# Altium project USB_Hub.PrjPcb
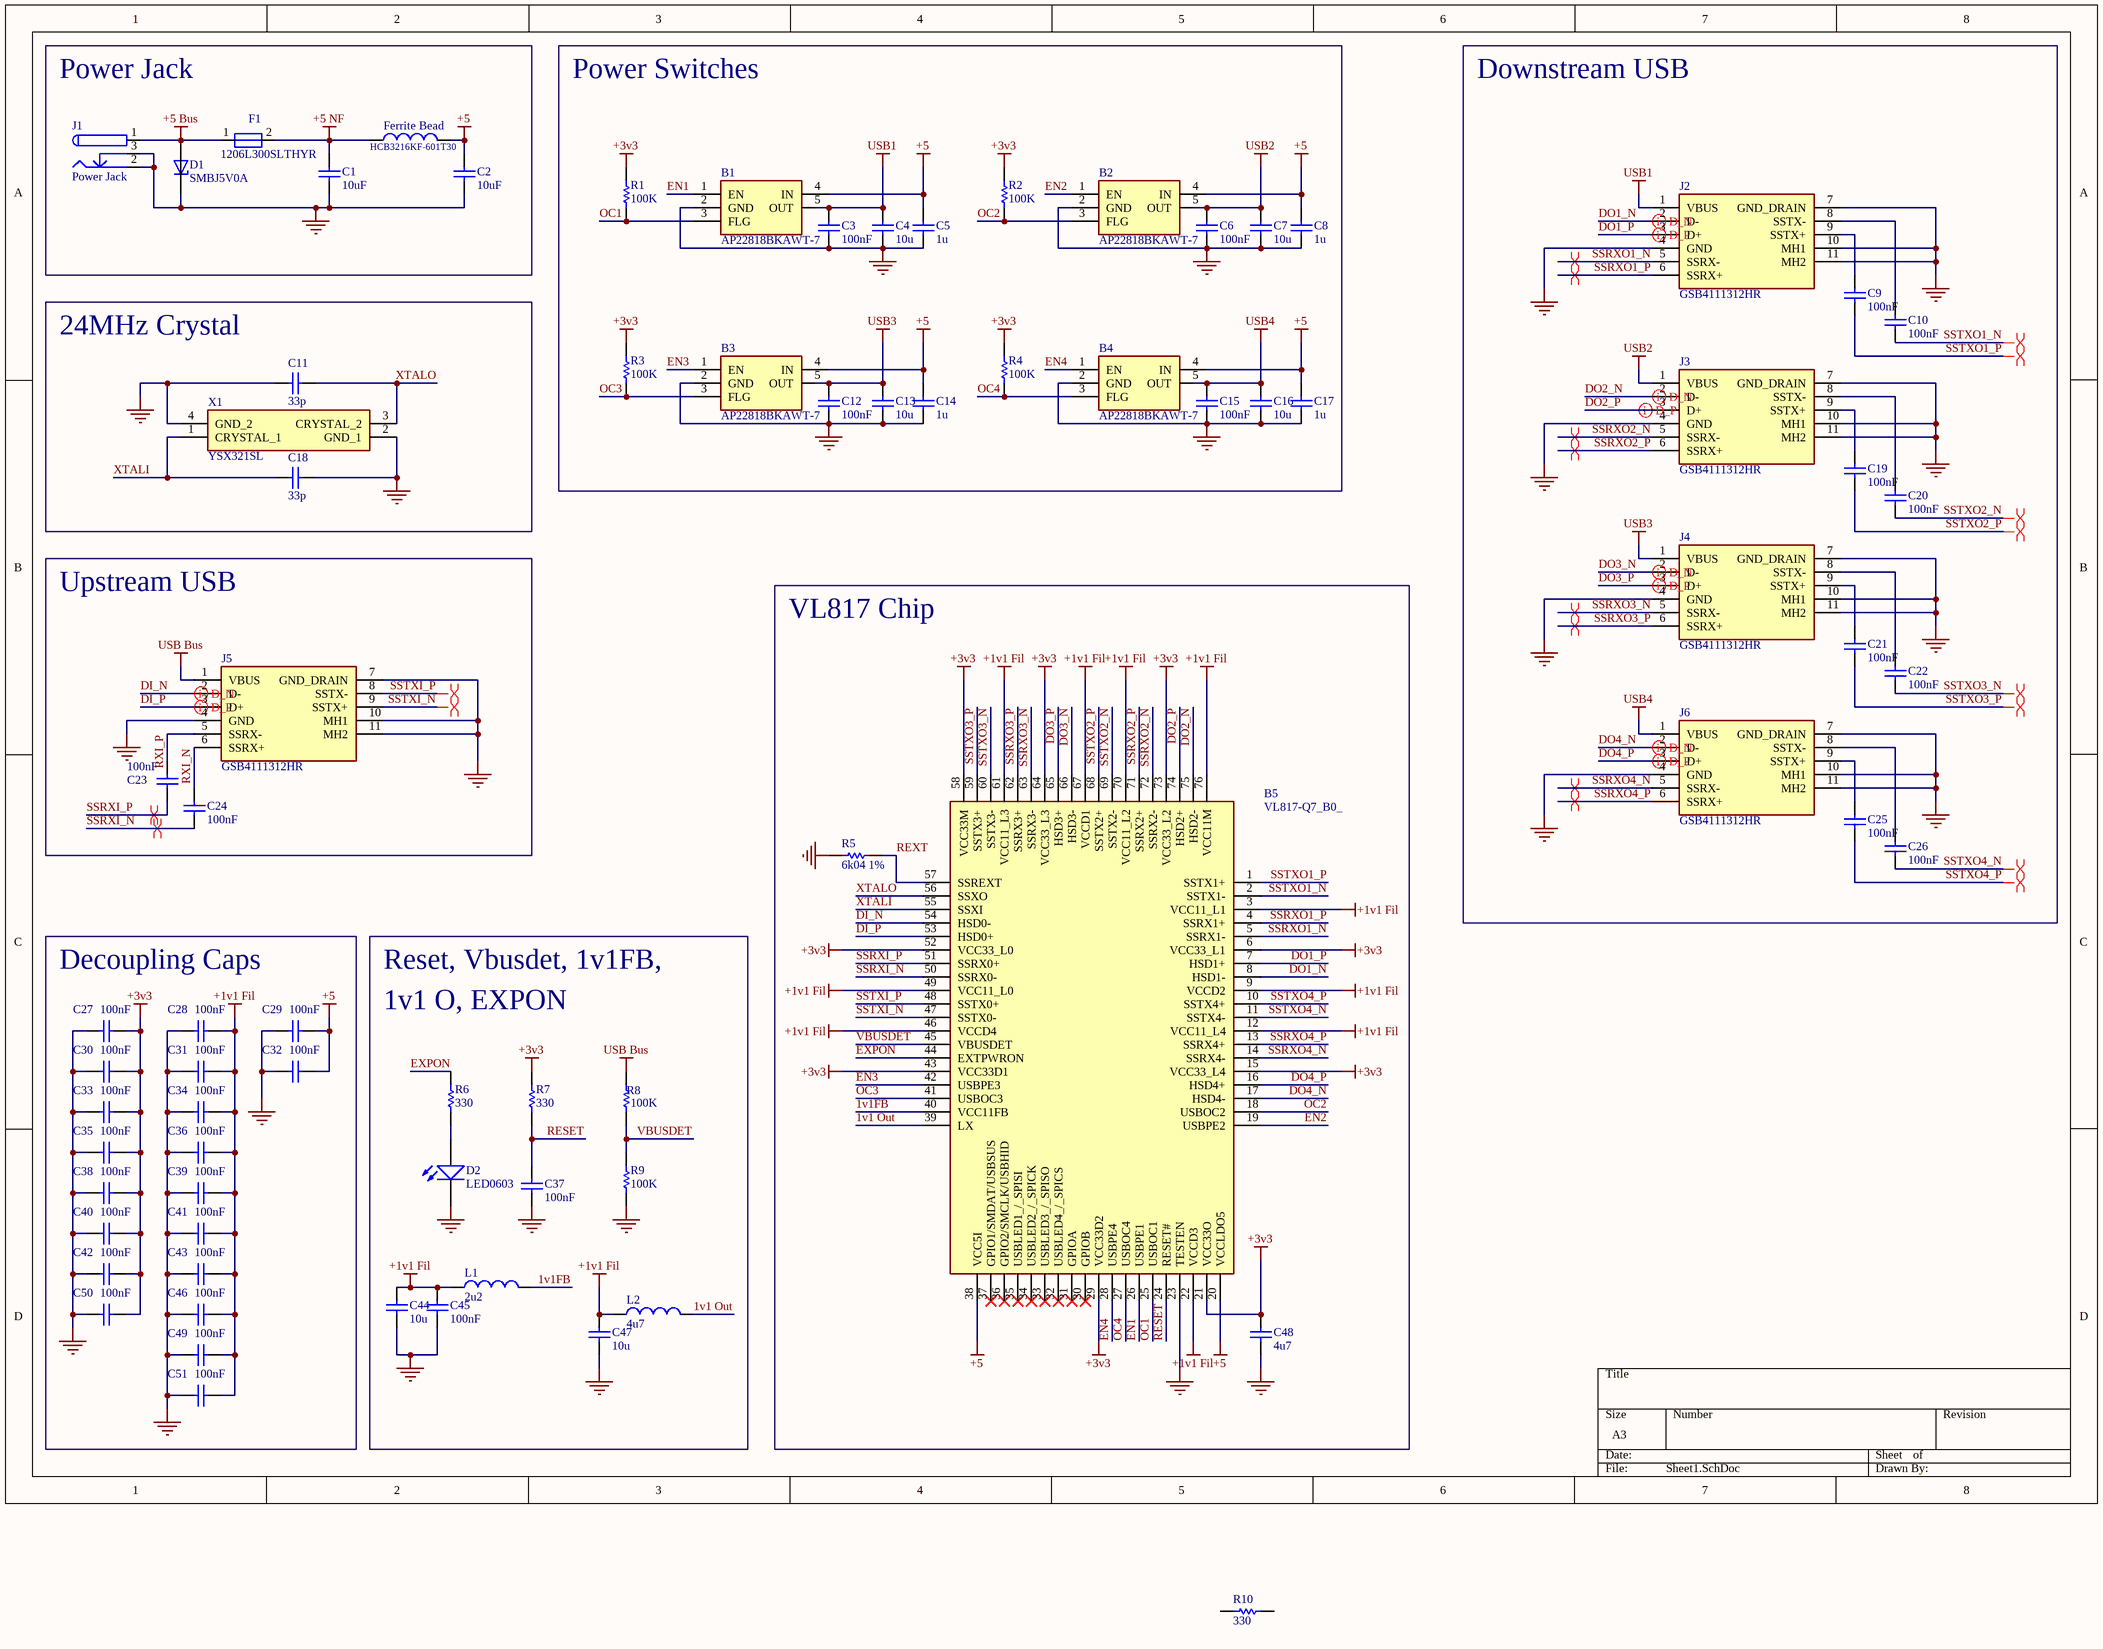
[diagram p0: Sheet1.SchDoc]
1 sheet, 79 parts. Net scope: global (net labels, ports and power ports of the same name join across sheets).
Board file: Hub.PcbDoc

## Sheet Sheet1.SchDoc
size A3; SheetNumber: 3; SheetTotal: 3

### Parts
B1  AP22818BKAWT-7  [SOT95P280X100-5N]
B2  AP22818BKAWT-7  [SOT95P280X100-5N]
B3  AP22818BKAWT-7  [SOT95P280X100-5N]
B4  AP22818BKAWT-7  [SOT95P280X100-5N]
B5  VL817-Q7_B0_  [QFN40P900X900X90-77N-D]
C1  10uF  [CAP1206]
C2  10uF  [CAP1206]
C3  100nF  [CAP0402]
C4  10u  [CAP0603]
C5  1u  [CAP0603]
C6  100nF  [CAP0402]
C7  10u  [CAP0603]
C8  1u  [CAP0603]
C9  100nF  [CAP0402]
C10  100nF  [CAP0402]
C11  33p  [CAP0402]
C12  100nF  [CAP0402]
C13  10u  [CAP0603]
C14  1u  [CAP0603]
C15  100nF  [CAP0402]
C16  10u  [CAP0603]
C17  1u  [CAP0603]
C18  33p  [CAP0402]
C19  100nF  [CAP0402]
C20  100nF  [CAP0402]
C21  100nF  [CAP0402]
C22  100nF  [CAP0402]
C23  100nF  [CAP0402]
C24  100nF  [CAP0402]
C25  100nF  [CAP0402]
C26  100nF  [CAP0402]
C27  100nF  [CAP0402]
C28  100nF  [CAP0402]
C29  100nF  [CAP0402]
C30  100nF  [CAP0402]
C31  100nF  [CAP0402]
C32  100nF  [CAP0402]
C33  100nF  [CAP0402]
C34  100nF  [CAP0402]
C35  100nF  [CAP0402]
C36  100nF  [CAP0402]
C37  100nF  [CAP0402]
C38  100nF  [CAP0402]
C39  100nF  [CAP0402]
C40  100nF  [CAP0402]
C41  100nF  [CAP0402]
C42  100nF  [CAP0402]
C43  100nF  [CAP0402]
C44  10u  [CAP0603]
C45  100nF  [CAP0402]
C46  100nF  [CAP0402]
C47  10u  [CAP0603]
C48  4u7  [CAP0603]
C49  100nF  [CAP0402]
C50  100nF  [CAP0402]
C51  100nF  [CAP0402]
D1  SMBJ5V0A  [DIOM4336X265N]
D2  LED0603  [LED_SMD_0603]
F1  1206L300SLTHYR  [FUSC3115X66N]
Ferrite_Bead  HCB3216KF-601T30  [IND1206]
J1  Power Jack  [Power Jack]
J2  GSB4111312HR  [GSB4111312HR]
J3  GSB4111312HR  [GSB4111312HR]
J4  GSB4111312HR  [GSB4111312HR]
J5  GSB4111312HR  [GSB4111312HR]
J6  GSB4111312HR  [GSB4111312HR]
L1  2u2  [IND0603]
L2  4u7  [IND0603]
R1  100K  [RES0603]
R2  100K  [RES0603]
R3  100K  [RES0603]
R4  100K  [RES0603]
R5  6k04 1%  [RES0603]
R6  330  [RES0603]
R7  330  [RES0603]
R8  100K  [RES0603]
R9  100K  [RES0603]
R10  value 330  [Res50]  (hidden comment: Resistor vertical)
X1  YSX321SL  [YSX321SL]

### Blocks framed on the sheet
Power Jack: C1 C2 D1 F1 Ferrite_Bead J1
Power Switches: B1-B4 C3-C8 C12-C17 R1-R4
Downstream USB: C9 C10 C19-C22 C25 C26 J2-J4 J6
24MHz Crystal: C11 C18 X1
Upstream USB: C23 C24 J5
VL817 Chip: B5 C48 R5
Decoupling Caps: C27-C36 C38-C43 C46 C49-C51

### Nets
+1v1 Fil: B5.3(VCC11_L1) B5.9(VCCD2) B5.12(VCC11_L4) B5.22(VCCD3) B5.46(VCCD4) B5.49(VCC11_L0) B5.61(VCC11_L3) B5.67(VCCD1) B5.70(VCC11_L2) B5.76(VCC11M) C28.2 C31.2 C34.2 C36.2 C39.2 C41.2 C43.2 C44.2 C45.2 C46.2 C47.2 C49.2 C51.2 L1.1 L2.1
+3v3: B5.6(VCC33_L1) B5.15(VCC33_L4) B5.21(VCC33O) B5.29(VCC33D2) B5.43(VCC33D1) B5.52(VCC33_L0) B5.58(VCC33M) B5.64(VCC33_L3) B5.73(VCC33_L2) C27.2 C30.2 C33.2 C35.2 C38.2 C40.2 C42.2 C48.2 C50.2 R1.2 R2.2 R3.2 R4.2 R7.2
+5: B1.4(IN) B2.4(IN) B3.4(IN) B4.4(IN) B5.20(VCCLDO5) B5.38(VCC5I) C2.2 C5.2 C8.2 C14.2 C17.2 C29.2 C32.2 Ferrite_Bead.2
+5 Bus: D1.A F1.1 J1.1
+5 NF: C1.2 F1.2 Ferrite_Bead.1
GND: B1.2(GND) B2.2(GND) B3.2(GND) B4.2(GND) B5.23(TESTEN) C1.1 C2.1 C3.1 C4.1 C5.1 C6.1 C7.1 C8.1 C11.2 C12.1 C13.1 C14.1 C15.1 C16.1 C17.1 C18.1 C27.1 C28.1 C29.1 C30.1 C31.1 C32.1 C33.1 C34.1 C35.1 C36.1 C37.1 C38.1 C39.1 C40.1 C41.1 C42.1 C43.1 C44.1 C45.1 C46.1 C47.1 C48.1 C49.1 C50.1 C51.1 D1.C D2.1(K) J1.2 J1.3 J2.4(GND) J2.7(GND_DRAIN) J2.10(MH1) J2.11(MH2) J3.4(GND) J3.7(GND_DRAIN) J3.10(MH1) J3.11(MH2) J4.4(GND) J4.7(GND_DRAIN) J4.10(MH1) J4.11(MH2) J5.4(GND) J5.7(GND_DRAIN) J5.10(MH1) J5.11(MH2) J6.4(GND) J6.7(GND_DRAIN) J6.10(MH1) J6.11(MH2) R5.2 R9.1 X1.2(GND_1) X1.4(GND_2)
USB1: B1.5(OUT) C3.2 C4.2 J2.1(VBUS)
USB2: B2.5(OUT) C6.2 C7.2 J3.1(VBUS)
USB3: B3.5(OUT) C12.2 C13.2 J4.1(VBUS)
USB4: B4.5(OUT) C15.2 C16.2 J6.1(VBUS)
USB Bus: J5.1(VBUS) R8.2
1v1 Out: B5.39(LX) L2.2
1v1FB: B5.40(VCC11FB) L1.2
DI_N: B5.54(HSD0-) J5.2(D-)
DI_P: B5.53(HSD0+) J5.3(D+)
DO1_N: B5.8(HSD1-) J2.2(D-)
DO1_P: B5.7(HSD1+) J2.3(D+)
DO2_N: B5.75(HSD2-) J3.2(D-)
DO2_P: B5.74(HSD2+) J3.3(D+)
DO3_N: B5.66(HSD3-) J4.2(D-)
DO3_P: B5.65(HSD3+) J4.3(D+)
DO4_N: B5.17(HSD4-) J6.2(D-)
DO4_P: B5.16(HSD4+) J6.3(D+)
EN1: B1.1(EN) B5.26(USBPE1)
EN2: B2.1(EN) B5.19(USBPE2)
EN3: B3.1(EN) B5.42(USBPE3)
EN4: B4.1(EN) B5.28(USBPE4)
EXPON: B5.44(EXTPWRON) R6.2
OC1: B1.3(FLG) B5.25(USBOC1) R1.1
OC2: B2.3(FLG) B5.18(USBOC2) R2.1
OC3: B3.3(FLG) B5.41(USBOC3) R3.1
OC4: B4.3(FLG) B5.27(USBOC4) R4.1
RESET: B5.24(RESET#) C37.2 R7.1
REXT: B5.57(SSREXT) R5.1
RXI_N: C24.2 J5.6(SSRX+)
RXI_P: C23.2 J5.5(SSRX-)
SSRXI_N: B5.50(SSRX0-) C24.1
SSRXI_P: B5.51(SSRX0+) C23.1
SSRXO1_N: B5.5(SSRX1-) J2.5(SSRX-)
SSRXO1_P: B5.4(SSRX1+) J2.6(SSRX+)
SSRXO2_N: B5.72(SSRX2-) J3.5(SSRX-)
SSRXO2_P: B5.71(SSRX2+) J3.6(SSRX+)
SSRXO3_N: B5.63(SSRX3-) J4.5(SSRX-)
SSRXO3_P: B5.62(SSRX3+) J4.6(SSRX+)
SSRXO4_N: B5.14(SSRX4-) J6.5(SSRX-)
SSRXO4_P: B5.13(SSRX4+) J6.6(SSRX+)
SSTXI_N: B5.47(SSTX0-) J5.9(SSTX+)
SSTXI_P: B5.48(SSTX0+) J5.8(SSTX-)
SSTXO1_N: B5.2(SSTX1-) C10.1
SSTXO1_P: B5.1(SSTX1+) C9.1
SSTXO2_N: B5.69(SSTX2-) C20.1
SSTXO2_P: B5.68(SSTX2+) C19.1
SSTXO3_N: B5.60(SSTX3-) C22.1
SSTXO3_P: B5.59(SSTX3+) C21.1
SSTXO4_N: B5.11(SSTX4-) C26.1
SSTXO4_P: B5.10(SSTX4+) C25.1
VBUSDET: B5.45(VBUSDET) R8.1 R9.2
XTALI: B5.55(SSXI) C18.2 X1.1(CRYSTAL_1)
XTALO: B5.56(SSXO) C11.1 X1.3(CRYSTAL_2)
NetC9_2: C9.2 J2.9(SSTX+)
NetC10_2: C10.2 J2.8(SSTX-)
NetC19_2: C19.2 J3.9(SSTX+)
NetC20_2: C20.2 J3.8(SSTX-)
NetC21_2: C21.2 J4.9(SSTX+)
NetC22_2: C22.2 J4.8(SSTX-)
NetC25_2: C25.2 J6.9(SSTX+)
NetC26_2: C26.2 J6.8(SSTX-)
NetD2_2: D2.2(A) R6.1

Not connected (* = marked no-connect by the designer): B5 30(GPIOB)* 31(GPIOA)* 32(USBLED4_/_SPICS)* 33(USBLED3_/_SPISO)* 34(USBLED2_/_SPICK)* 35(USBLED1_/_SPISI)* 36(GPIO2/SMCLK/USBHID)* 37(GPIO1/SMDAT/USBSUS)*; R10 1 2

### Layout directives
differential pair: DI_N, DI_P, DO1_N, DO1_P, DO2_N, DO2_P, DO3_N, DO3_P, DO4_N, DO4_P, SSRXI_N, SSRXI_P, SSRXO1_N, SSRXO1_P, SSRXO2_N, SSRXO2_P, SSRXO3_N, SSRXO3_P, SSRXO4_N, SSRXO4_P, SSTXI_N, SSTXI_P, SSTXO1_N, SSTXO1_P, SSTXO2_N, SSTXO2_P, SSTXO3_N, SSTXO3_P, SSTXO4_N, SSTXO4_P

### Notes on the sheet
- Reset, Vbusdet, 1v1FB,
- 1v1 O, EXPON

### Library data of the parts
B1-B4 = AP22818BKAWT-7: USB Switch ICs USB Power Switch TSOT25 T&R 3K; Manufacturer_Name: Diodes Incorporated; Geometry.Height: 1mm; Manufacturer_Part_Number: AP22818BKAWT-7; Mouser Part Number: 621-AP22818BKAWT-7; Mouser Price/Stock: https://www.mouser.co.uk/ProductDetail/Diodes-Incorporated/AP22818BKAWT-7?qs=7D1LtPJG0i00w4y0p06PMw%3D%3D; Arrow Part Number: AP22818BKAWT-7; Arrow Price/Stock: https://www.arrow.com/en/products/ap22818bkawt-7/diodes-incorporated?utm_currency=USD&region=nac; Datasheet Link: https://www.diodes.com/assets/Datasheets/AP22816_17_18.pdf
B5 = VL817-Q7_B0_: QFN-76_9x9x04P USB ICs RoHS; Manufacturer_Name: VIA; Manufacturer_Part_Number: VL817-Q7(B0); Geometry.Height: 0.9mm; Mouser Part Number: *; Mouser Price/Stock: *; Arrow Part Number: *; Arrow Price/Stock: *; Datasheet Link: https://item.szlcsc.com/210703.html
C1 C2 = CAP1206
C3 C6 C9-C12 C15 C18-C43 C45 C46 C49-C51 = CAP0402
C4 C5 C7 C8 C13 C14 C16 C17 C44 C47 C48 = CAP0603
D1 = SMBJ5V0A: DIODE, TVS, 5V, 600W, SMB; TVS Polarity:Unidirectional; Reverse Stand-Off Voltage Vrwm:5V; Breakdown Voltage Range:6.4V to 7V; Clamping Voltage Vc Max:9.2V; Peak Pulse Current Ippm:65.2A; Diode Case Style:SMB; No. of Pins:2; SVHC:No SVHC (19-Dec-2011); Al; MF: Fairchild Semiconductor; SnapEDA_Link: https://www.snapeda.com/parts/SMBJ5V0A/Fairchild+Imaging/view-part/?ref=snap; Package: SMB-2 Fairchild Semiconductor; Value: *; MP: SMBJ5V0A; Check_prices: https://www.snapeda.com/parts/SMBJ5V0A/Fairchild+Imaging/view-part/?ref=eda
D2 = LED_SMD_0603
F1 = 046602.5NRHF: 475 Series 1206 Fast-Acting Fuse; MF: Littelfuse; SnapEDA_Link: https://www.snapeda.com/parts/046602.5NRHF/Littelfuse/view-part/?ref=snap; Package: None; Value: *; MP: 046602.5NRHF; Check_prices: https://www.snapeda.com/parts/046602.5NRHF/Littelfuse/view-part/?ref=eda
Ferrite_Bead = IND1206
J1 = Power Jack: Designer: Saeid Jorablo; Company: Personal; Project Name: Laser; Adding Date: 10/21/2009
J2-J6 = GSB4111312HR: USB 3.2 GEN 2, Type A, Receptacle, Right Angle, 9 Pins, Shell with Nickel Plating, 30uin Gold, Dip 2.4mm, Blue High Temperature Housing, Tray Packaging; Manufacturer_Name: Amphenol Communications Solutions; Geometry.Height: 7.94mm; Manufacturer_Part_Number: GSB4111312HR; Mouser Part Number: *; Mouser Price/Stock: *; Arrow Part Number: *; Arrow Price/Stock: *; Datasheet Link: https://cdn.amphenol-cs.com/media/wysiwyg/files/drawing/gsb4111xxxhr.pdf
L1 L2 = IND0603
R1-R9 = RES0603
R10 = Resistor vertical: Resistor 0.5; Publisher: Seyed mohsen ghasemian; WEB: www.picpars.com
X1 = YSX321SL: Crystal; Manufacturer_Name: YXC; Geometry.Height: 0.8mm; Manufacturer_Part_Number: YSX321SL; Mouser Part Number: *; Mouser Price/Stock: *; Arrow Part Number: *; Arrow Price/Stock: *; Datasheet Link: https://datasheet.lcsc.com/szlcsc/YSX321SL-30MHZ-10PF-8PPM_C70576.pdf